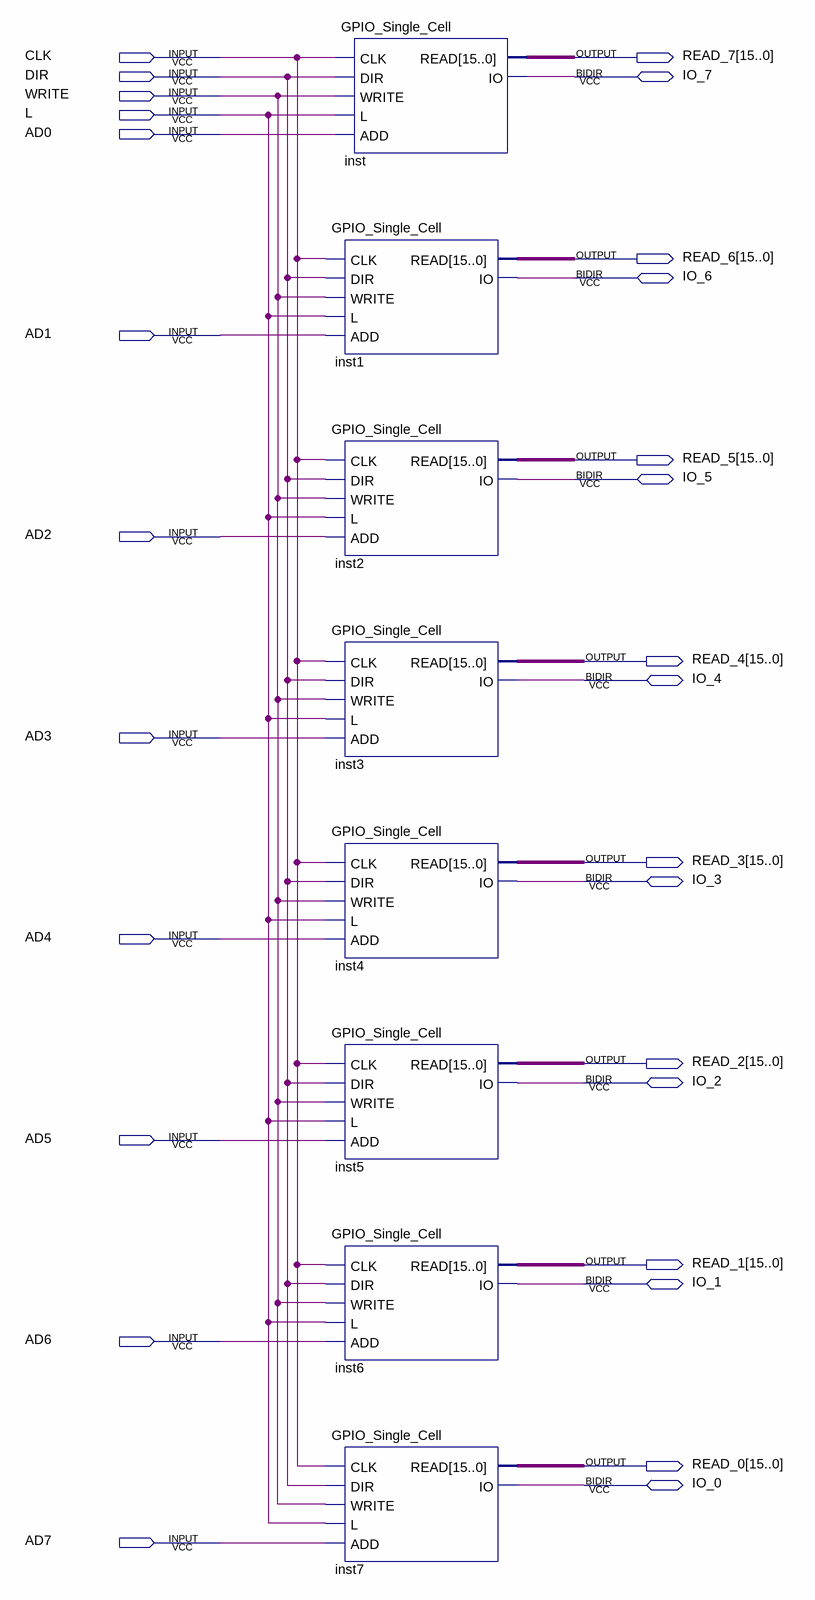
[diagram p0: schematic sheet]
// Quartus schematic GPIO_A.bdf as structural Verilog: 8 symbols, 28 pins
module GPIO_A (
  input  CLK,
  input  DIR,
  input  WRITE,
  input  L,
  input  AD0,
  input  AD1,
  input  AD2,
  input  AD3,
  input  AD4,
  input  AD5,
  input  AD6,
  input  AD7,
  inout  IO_7,
  inout  IO_6,
  inout  IO_5,
  inout  IO_4,
  inout  IO_3,
  inout  IO_2,
  inout  IO_1,
  inout  IO_0,
  output [15:0] READ_7,
  output [15:0] READ_6,
  output [15:0] READ_5,
  output [15:0] READ_4,
  output [15:0] READ_3,
  output [15:0] READ_2,
  output [15:0] READ_1,
  output [15:0] READ_0
);

  GPIO_Single_Cell inst (.CLK(CLK), .DIR(DIR), .WRITE(WRITE), .L(L), .ADD(AD0), .READ(READ_7), .IO(IO_7));
  GPIO_Single_Cell inst1 (.CLK(CLK), .DIR(DIR), .WRITE(WRITE), .L(L), .ADD(AD1), .READ(READ_6), .IO(IO_6));
  GPIO_Single_Cell inst2 (.CLK(CLK), .DIR(DIR), .WRITE(WRITE), .L(L), .ADD(AD2), .READ(READ_5), .IO(IO_5));
  GPIO_Single_Cell inst3 (.CLK(CLK), .DIR(DIR), .WRITE(WRITE), .L(L), .ADD(AD3), .READ(READ_4), .IO(IO_4));
  GPIO_Single_Cell inst4 (.CLK(CLK), .DIR(DIR), .WRITE(WRITE), .L(L), .ADD(AD4), .READ(READ_3), .IO(IO_3));
  GPIO_Single_Cell inst5 (.CLK(CLK), .DIR(DIR), .WRITE(WRITE), .L(L), .ADD(AD5), .READ(READ_2), .IO(IO_2));
  GPIO_Single_Cell inst6 (.CLK(CLK), .DIR(DIR), .WRITE(WRITE), .L(L), .ADD(AD6), .READ(READ_1), .IO(IO_1));
  GPIO_Single_Cell inst7 (.CLK(CLK), .DIR(DIR), .WRITE(WRITE), .L(L), .ADD(AD7), .READ(READ_0), .IO(IO_0));
endmodule
